# EAGLE schematic 60-hv-amp-soft-start (EAGLE 6.6.0)
AUTHOR: Sean Leavey; COMPANY: Institute for Gravitational Research; DATE: 2016-04-19; DESCRIPTION: Differential output +/-400V; FRMLATEXSYNTAX: 0; INFOSETTINGS: Used by 'plot.ulp' - do not edit manually! |FileTime=2016-07-15, 15:03:05|FileVersion=2||[LabelBox]|Company=Institute for Gravitational Research|Title=Quad Differential HV Amplifier|Description=Differential output +-350V|Revision=2016-03-22|Date=2016-03-22|Author=Sean Leavey|RevisionDate1=2016-05-30|RevisionAuthor1=Sean Leavey|RevisionDate2=2016-07-15|RevisionAuthor2=Sean Leavey|RevisionDate3=|RevisionAuthor3=|RevisionDate4=|RevisionAuthor4=|RevisionDate5=|RevisionAuthor5=||[FrontMatter]|DocTitle=Quad differential HV amplifier|SubTitle=Circuit board documentation|Authors=Sean Leavey|Keywords=|Abstract=This circuit provides four differential HV amplifier channels with +/-10V differential input and up to +/-400V differential output. Switchable whitening is provided to allow for additional filtering. This is switched via digital CMOS integrated circuits, and a connector compatible with the ERC Speedmeter project's CDS digital signalling system must be utilised. In addition, further connectors are provided for monitor signals and front panel indicator LEDs.\n\nThere are 8 x PA95 power amplifiers on this board which produce considerable heat. You must attach these amplifiers to a heat sink, and isolated copper has been left at the top of the board to do so. Two sockets are available for the attachment of 12V fans, but these are not strictly necessary depending on the chosen enclosure, heat sink and available air flow - use common sense.\n\nThis board contains numerous vias which must be populated prior to operation. Use the vias diagram in this documentation to find their locations, and make a visual inspection to make sure there are no unsoldered component legs where there are connected tracks. If in doubt, solder it!\n\nIt is highly recommended to build this board in a modular form, testing it as you go. There are test pins provided for most critical signal paths. It will be difficult to debug this circuit after it is complete.\n\nResistors should have 1% tolerance unless otherwise stated. This includes the HV feedback resistors.|LaTeXSyntax=1||[Safety]|VoltageHazard=1|HeatHazard=1|Convection=1|ForcedAir=1|WaterCooling=0|LightHazard=0|LaserPower=1000|LaserWavelength=1064|LaserClass=6|LightPower=1000|LightInvisible=0||[Notes]|Machinery=0|IntendedUsers=0|DisplayHints=1|; PLOTSETTINGS: Used by 'plot.ulp' - do not edit manually! |FileTime=2016-07-15, 15:03:05|FileVersion=2||[Board]|CreateBoard=0|PadDisplay=0|CreateDrillPlan=0|SiebMeyerFormat=0|IsiDrillFormat=0|CreateSolderStop=0|CreateCreamMask=0|CreateLegend=0|DisplayDimension=0|DisplayReference=1|CompensateSkew=1||[Documentation]|CreateDocumentation=1|CreateSheetDocs=1|DisplayNames=1|DisplayValues=1|DisplaySimulate=0|CreatePartList=0|CreateBoardDocs=1|CreatePlaceplan=1|DisplayJumper=0|CreateWiring=0|DisplayVias=1|CreateDrillMap=1|Create800uMap=0|CreatePreview=0|CreateValueList=1|CreateNetList=0|CreateLaTeX=1||[Variants]|HighlightUndefines=1|HighlightVariants=1|ShowVariantLists=1||[BoardSetup]|ProcessPolygons=0|PageSize=1|PageOrientation=0|MarginLeft=5|MarginTop=5|MarginRight=5|MarginBottom=5|DrillRackMM=0||[DocumentationSetup]|BlackWhite=0|FigureWidth=168|FigureHeight=237|ShrinkFigure=1|ExpandFigure=0|FigureRotate=1|TextWidth=72|ValueLibrary=1|PalatinoFont=1|LuximonoFont=1|IgnoreWidth=1||[MiscSetup]|OutlinePrecision=0.5|OutlineDiameter=2|; REVISION: v2.1; REVISIONAUTHOR1: Sean Leavey; REVISIONAUTHOR2: Sean Leavey; REVISIONDATE1: 2016-05-30; REVISIONDATE2: 2016-07-15; TITLE: Quad Differential; TITLE2: HV Amplifier; VARIANTSETTINGS: Used by 'variants.ulp' - do not edit manually! |FileTime=2013-05-23, 16:49:02|FileVersion=1||Title0=0-400V|Description0=|
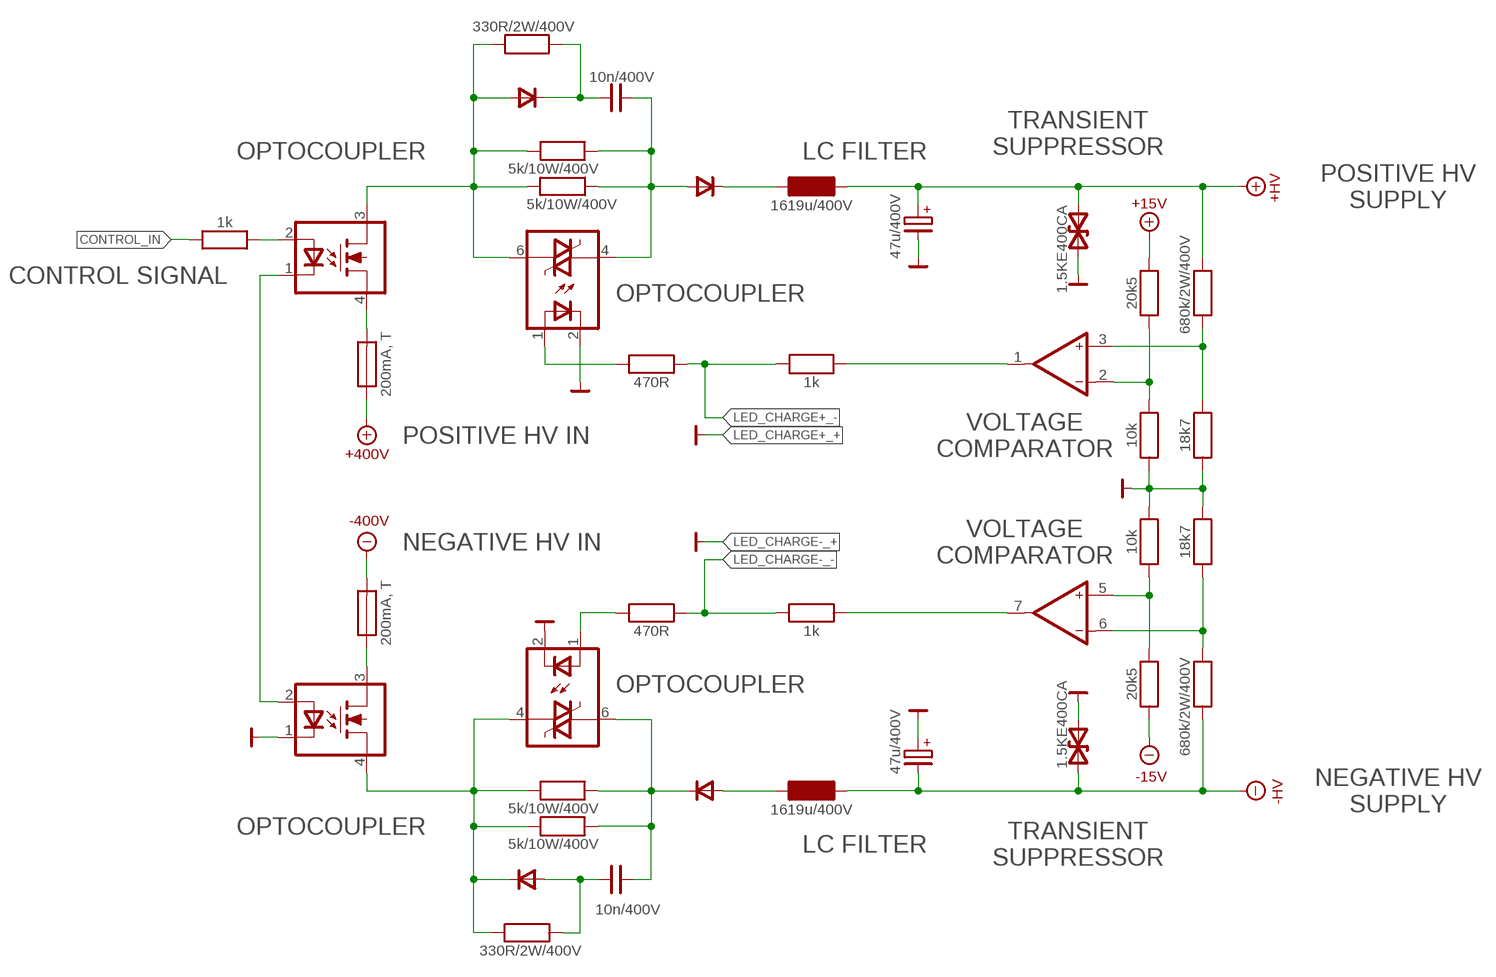
[diagram p0: schematic, sheet 1]

## Parts
C25  10n/400V  C03-CERAMIC-HV15-N  [C03-CERAMIC-HV15-N]
C26  10n/400V  C03-CERAMIC-HV15-N  [C03-CERAMIC-HV15-N]
C27  47u/400V  CE03-R18  [CE03-R18]
C28  47u/400V  CE03-R18  [CE03-R18]
D27  UF4007  D04B  [D04N-DO41-VALUE]
D28  UF4007  D04B  [D04N-DO41-VALUE]
D29  UF4007  D04B  [D04N-DO41-VALUE]
D30  UF4007  D04B  [D04N-DO41-VALUE]
D31  1.5KE400CA  DSB  [DSB06N2]
D32  1.5KE400CA  DSB  [DSB06N2]
F1  200mA, T  F  [F02]
F2  200mA, T  F  [F02]
L1  1619u/400V  L12-6X26  [L12-6X26]
L2  1619u/400V  L12-6X26  [L12-6X26]
N25  AQZ204  AQZ202  [AQZ-N]
N26  AQZ204  AQZ202  [AQZ-N]
N27  IL420  [DIP06L]
N28  IL420  [DIP06L]
N29  OPA2277  OPA2277L  [DIP08L]
R113  1k  R04  [R04N]
R114  330R/2W/400V  R06-2W  [R06-2W]
R115  5k/10W/400V  R02A  [TO220-2A]
R116  5k/10W/400V  R02A  [TO220-2A]
R117  5k/10W/400V  R02A  [TO220-2A]
R118  5k/10W/400V  R02A  [TO220-2A]
R119  330R/2W/400V  R06-2W  [R06-2W]
R120  470R  R04N  [R04N]
R121  470R  R04N  [R04N]
R122  1k  R04N  [R04N]
R123  1k  R04N  [R04N]
R124  20k5  R04N  [R04N]
R125  10k  R  [R04N]
R126  10k  R04N  [R04N]
R127  20k5  R04N  [R04N]
R128  680k/2W/400V  R06-2W  [R06-2W]
R129  18k7  R04N  [R04N]
R130  18k7  R04N  [R04N]
R131  680k/2W/400V  R06-2W  [R06-2W]

## Nets
+15V: R124.2 ; supply symbol labelled V+15V
+400V [HV]: F1.1 ; supply symbol labelled V+400V
+HV [HV]: C27.+ D31.2 L1.2 R128.2 ; supply symbol labelled V+HV
-15V: R127.1 ; supply symbol labelled V-15V
-400V [HV]: F2.2 ; supply symbol labelled V-400V
-HV [HV]: C28.- D32.1 L2.2 R131.1 ; supply symbol labelled V-HV
CONTROL_IN: R113.1
GND: C27.- C28.+ D31.1 D32.2 N26.1(C) N27.2(C) N28.2(C) R125.1 R126.2 R129.1 R130.2 ; supply symbol labelled VG
LED_CHARGE+_-: R120.2 R122.2
LED_CHARGE-_-: R121.2 R123.2
N$1 [HV]: C25.1 D28.A R119.1
N$53 [HV]: D30.A L2.1
N$54 [HV]: D29.C L1.1
N$55: N25.1(C) N26.2(A)
N$56 [HV]: D27.A N25.3(OUT1) N27.6(MT2) R114.1 R115.1 R116.2
N$57: N25.2(A) R113.2
N$62: N27.1(A) R120.1
N$80 [HV]: F2.1 N26.3(OUT1)
N$81 [HV]: F1.2 N25.4(OUT2)
N$84: N29.5(B:IN+) R126.1 R127.2
N$89: N29.2(A:IN-) R124.1 R125.2
N$90: N29.1(A:OUT) R122.1
N$91: N29.6(B:IN-) R130.1 R131.2
N$94: N29.3(A:IN+) R128.1 R129.2
N$96 [HV]: D28.C N26.4(OUT2) N28.4(MT1) R117.2 R118.1 R119.2
N$97: N29.7(B:OUT) R123.1
N$116 [HV]: C25.2 D30.C N28.6(MT2) R117.1 R118.2
N$123: N28.1(A) R121.1
N$126 [HV]: C26.2 D29.A N27.4(MT1) R115.2 R116.1
N$131 [HV]: C26.1 D27.C R114.2

## Notes on the sheet
- TRANSIENT
  SUPPRESSOR
- OPTOCOUPLER | LC FILTER
- POSITIVE HV
  SUPPLY
- CONTROL SIGNAL
- OPTOCOUPLER
- POSITIVE HV IN
- VOLTAGE
  COMPARATOR
- NEGATIVE HV IN
- VOLTAGE
  COMPARATOR
- OPTOCOUPLER
- NEGATIVE HV
  SUPPLY
- OPTOCOUPLER
- LC FILTER
- TRANSIENT
  SUPPRESSOR

## Power pins joined to a net without a drawn wire
V+: N29.8(P:V+)
V-: N29.4(P:V-)

## Library data of the parts
C25 C26 = miscs:C: Capacitor, bipolar _____ Supported SPICE attributes: VALUE, VOLTAGE, CPARALLEL, LSERIES, RLSHUNT, RPARALLEL, RSERIES (A detailed description of these parameters can be found in the library spice.lbr) _____ References (PDF files, electronics workshop server): WIMA FKP 02 <http://elektronik.aei.uni-hannover.de:3000/datasheets/capacitors/wima-fkp02.pdf> (polypropylene film capacitors, 0.1" spacing) WIMA FKP 2 <http://elektronik.aei.uni-hannover.de:3000/datasheets/capacitors/wima-fkp2.pdf> (polypropylene film capacitors, 0.2" spacing) WIMA FKS 2 <http://elektronik.aei.uni-hannover.de:3000/datasheets/capacitors/wima-fks2.pdf> (polyester film capacitors, 0.2" spacing) WIMA MKP 2 <http://elektronik.aei.uni-hannover.de:3000/datasheets/capacitors/wima-mkp2.pdf> (polypropylene film capacitors, 0.2" spacing) WIMA MKS 02 <http://elektronik.aei.uni-hannover.de:3000/datasheets/capacitors/wima-mks02.pdf> (polyester film capacitors, 0.1" spacing) WIMA MKS 2 <http://elektronik.aei.uni-hannover.de:3000/datasheets/capacitors/wima-mks2.pdf> (polyester film capacitors, 0.2" spacing) Kemet ceramics <http://elektronik.aei.uni-hannover.de:3000/datasheets/capacitors/kemet-ceramics.pdf> (multilayer ceramic leaded capacitors) Vishay ceramics HV <http://elektronik.aei.uni-hannover.de:3000/datasheets/capacitors/vishay-ceramic-hv.pdf> (multilayer ceramic leaded capacitors, high voltage) LCR polystyrene <http://elektronik.aei.uni-hannover.de:3000/datasheets/capacitors/lcr-polystyrene.pdf> (polystyrene radial capacitors, 0.2" spacing); SPICE: <IDEALMODEL>\n<name:C> <pin:A.1> <pin:A.2> <autovalue><voltage: ic=>\n\n<REALMODEL>\n<name:C> <pin:A.1> <pin:A.2> <autovalue><voltage: ic=><rseries: rser=><lseries: lser=><rparallel: rpar=><cparallel: cpar=><rlshunt: rlshunt=>
C27 C28 = miscs:CE: Electrolytic capacitor, unipolar _____ SPICE implementation as a bipolar capacitor with the supported attributes: VALUE, VOLTAGE, CPARALLEL, LSERIES, RLSHUNT, RPARALLEL, RSERIES (A detailed description of these parameters can be found in the library spice.lbr); SPICE: <IDEALMODEL>\n<name:C> <pin:A.+> <pin:A.-> <autovalue><voltage: ic=>\n\n<REALMODEL>\n<name:C> <pin:A.+> <pin:A.-> <autovalue><voltage: ic=><rseries: rser=><lseries: lser=><rparallel: rpar=><cparallel: cpar=><rlshunt: rlshunt=>
D27-D30 = diodes:D: Diode _____ Supported SPICE attributes: VALUE, TEMPERATURE (A detailed description of these parameters can be found in the library spice.lbr); SPICE: <name:D> <pin:A.A> <pin:A.C> <model:<value>><temperature: temp=>
D31 D32 = diodes:DSB: Suppressor diode, bidirectional - e.g., Transil (STMicroelectronics); VALUE: DSB
F1 F2 = miscs:F: Fuse _____ SPICE implementation as a 30mΩ resistor; SPICE: <name:R> <pin:A.1> <pin:A.2> 30m
L1 L2 = miscs:L: Coil, European symbol _____ Supported SPICE attributes: VALUE, CURRENT, CPARALLEL, RPARALLEL, RSERIES (A detailed description of these parameters can be found in the library spice.lbr); SPICE: <IDEALMODEL>\n<name:L> <pin:A.1> <pin:A.2> <autovalue><current: ic=>\n\n<REALMODEL>\n<name:L> <pin:A.1> <pin:A.2> <autovalue><current: ic=><rseries: rser=><rparallel: rpar=><cparallel: cpar=>
N25 N26 = optos:AQZ20*
N27 N28 = optos:IL420
N29 = opamps:OPA2277: OPA2277: Dual high precision opamp (Burr-Brown) ±15V, ±35mA, 4nA bias 50µV offset, 1MHz UGF, 8nV/rt(Hz) noise _____ References: - PDF datasheet <http://elektronik.aei.uni-hannover.de:3000/datasheets/opamps/opamps/opa2277.pdf> (electronics workshop server) - Manufacturer's link <http://www.ti.com/product/opa2277> (Texas Instruments website) - Internet search <http://www.google.de/search?q=opa2277 amplifier> (Google results) _____ Supported SPICE subcircuits: OPA277; SPICE: <gate:A>\n <name:X> <pin:A.IN+> <pin:A.IN-> <pin:P.V+> <pin:P.V-> <pin:A.OUT> <subckt:OPA277>\n\n<gate:B>\n <name:X> <pin:B.IN+> <pin:B.IN-> <pin:P.V+> <pin:P.V-> <pin:B.OUT> <subckt:OPA277>\n\n<gate:P>\n <ignore>
R113-R131 = miscs:R: Resistor, European symbol _____ Supported SPICE attributes: VALUE (A detailed description of these parameters can be found in the library spice.lbr); SPICE: <name:R> <pin:A.1> <pin:A.2> <autovalue>

## Net classes
0 default: width 0.813 mm, drill 0.813 mm, clearance 0.406 mm
1 HV: width 1.626 mm, drill 0.813 mm, clearance 0.813 mm